# Altium schematic sheet 600Hz_LO_LPF.SchDoc: LF AD630 LPF
size A4; Organization: Altium Limited; Address1: L3, 12a Rodborough Rd; Address2: Frenchs Forest; Address3: NSW; Address4: Australia 2086
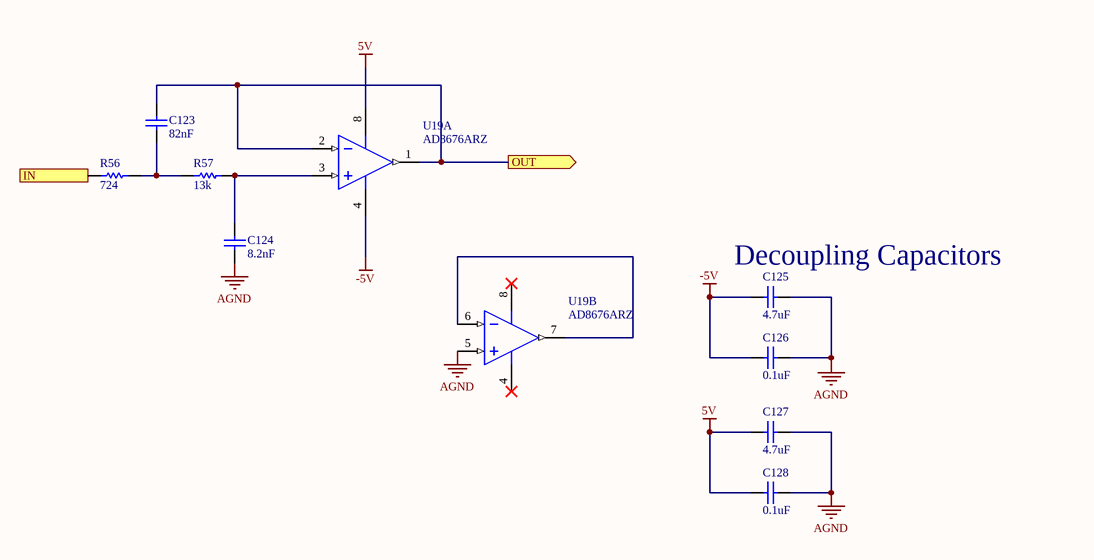
[diagram p0: 600Hz_LO_LPF.SchDoc]

## Parts
C123  82nF  [0402_Cap]
C124  8.2nF  [0402_Cap]
C125  4.7uF  [0402_Cap]
C126  0.1uF  [0402_Cap]
C127  4.7uF  [0402_Cap]
C128  0.1uF  [0402_Cap]
R56  724  [0402_Res]
R57  13k  [0402_Res]
U19  AD8676ARZ  [ADI-R-8_M]  (parts A,B of 2)

## Ports
IN (in), OUT (out)

## Nets
5V: C127.1 C128.1 U19.8(+V)
-5V: C125.1 C126.1 U19.4(-V)
AGND: C124.1 C125.2 C126.2 C127.2 C128.2 U19.5(+IN_B)
IN: R56.1 ; port IN
OUT: C123.2 U19.1(OUT_A) U19.2(-IN_A) ; port OUT
NetC123_1: C123.1 R56.2 R57.1
NetC124_2: C124.2 R57.2 U19.3(+IN_A)
NetU19_6: U19.6(-IN_B) U19.7(OUT_B)

## Notes on the sheet
- (near C125) Decoupling Capacitors
- Title
- Date:
- RE:
- Arturo di Girolamo
- Size:
- A3
- A

## Library data of the parts
C123 = 08051C163JAT2A: Capacitor, 16nF, 0805, 25V; ASYPN: GRM155R61A823KA01D; Value: 16nF; MFGPN: 08051C163JAT2A
C124 = GRM2165C2A162JA01D: Capacitor, 1.6nF, 0805, 25V; ASYPN: 0402B103K6R3CT; Value: 1.6nF; MFGPN: GRM2165C2A162JA01D
C125 C127 = CL21A475KAQNNNE: Capacitor, 4.7uF, 0805; Value: .01uf; ASYPN: GRM155R61A475MEAAD; MFGPN: CL21A475KAQNNNE
C126 C128 = CL21B104KACNNNC: Capacitor, 0.1uF, 0805; Value: .01uf; ASYPN: 0402YC104KAT2A; MFGPN: CL21B104KACNNNC
R56 = RC0805FR-071K65L: 1.65k; ASYPN: RMCF0402FT715R; Value: 1.65k; MFGPN: RC0805FR-071K65L
R57 = RC0805FR-075K9L: 5.9k; ASYPN: RMCF0402FT13K0; Value: 5.9k; MFGPN: RC0805FR-075K9L
U19 = CMP-0384-01145-2: Double Channel Wide Bandwidth Operational Amplifier, 10 MHz BW, 2.5 V/us SR, Industrial, 8-pin SOIC (R-8), Tube; Generic Part Number: AD8676; Manufacturer: Analog Devices; Input Offset Voltage: 12uV; Input Bias Current: 2.4nA; V Span Min: 10V; Iq/Amp: 2.7mA; V Span Max: 36V; Small Signal Bandwidth: 10MHz; Amplifiers Per Package: 2; Code_JEDEC: MS-012-AA; Mounting Technology: Surface Mount; Slew Rate: 2.5V/us; DatasheetVersion: Rev. C; ComponentLink2Description: Datasheet; ComponentLink3Description: Package Specification; PackageReference: R-8; ComponentLink1URL: http://www.analog.com/en/index.html; RevisionNote: Reference Circuit URL fixed; ComponentLink1Description: Manufacturer URL; ComponentLink2URL: http://www.analog.com/static/imported-files/data_sheets/AD8676.pdf; ComponentLink3URL: http://www.analog.com/static/imported-files/packages/PKG_PDF/SOIC_Narrow%20(R)/R_8.pdf; ComponentLink4Description: Reference Circuit; ComponentLink4URL: http://www.analog.com/en/all-operational-amplifiers-op-amps/operational-amplifiers-op-amps/ad8676/products/product.html#product-recommendations; PackageDescription: 8-Pin Standard Small Outline Package, Body 3.9 x 4.9 mm, Pitch 1.27 mm; PartNumber: AD8676ARZ; PackageVersion: 060506-A; ASYPN: AD8676ARZ